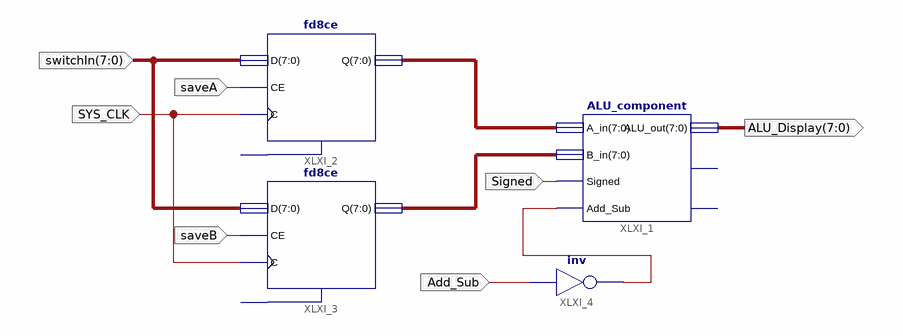
[diagram p0: schematic sheet 1]
// Xilinx ISE schematic alu_test.sch (spartan3e) as structural Verilog: 4 symbols, 7 ports
module alu_test (
  input  [7:0] switchIn,
  input  SYS_CLK,
  input  saveA,
  input  saveB,
  input  Signed,
  input  Add_Sub,
  output [7:0] ALU_Display
);

  wire XLXN_11;
  wire [7:0] XLXN_1, XLXN_2;

  ALU_component XLXI_1 (
    .A_in(XLXN_1), .B_in(XLXN_2), .Signed(Signed), .Add_Sub(XLXN_11), .ALU_out(ALU_Display));  // open: Overflow, Carryout
  fd8ce XLXI_2 (.C(SYS_CLK), .CE(saveA), .D(switchIn), .Q(XLXN_1));  // open: CLR
  fd8ce XLXI_3 (.C(SYS_CLK), .CE(saveB), .D(switchIn), .Q(XLXN_2));  // open: CLR
  not XLXI_4 (XLXN_11, Add_Sub);
endmodule
